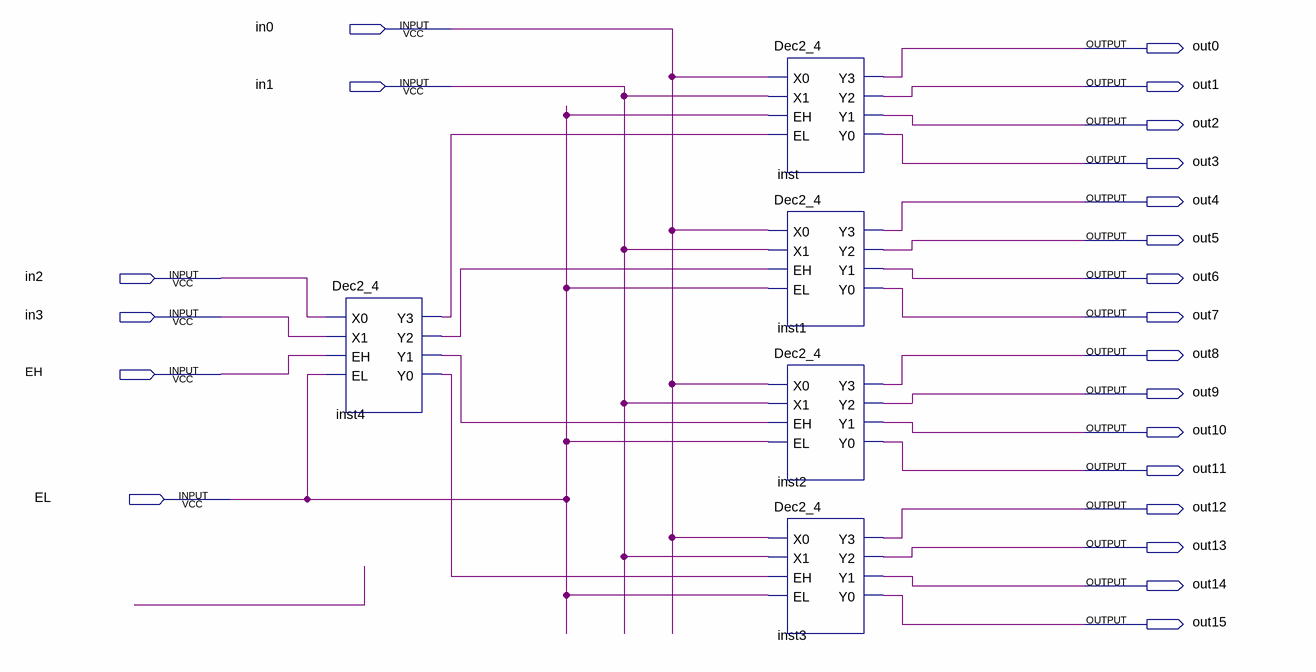
[diagram p0: schematic sheet]
// Quartus schematic Dec2_16.bdf as structural Verilog: 5 symbols, 22 pins
module Dec2_16 (
  input  in0,
  input  in1,
  input  in2,
  input  in3,
  input  EH,
  input  EL,
  output out0,
  output out1,
  output out2,
  output out3,
  output out4,
  output out5,
  output out6,
  output out7,
  output out8,
  output out9,
  output out10,
  output out11,
  output out12,
  output out13,
  output out14,
  output out15
);

  wire inst4_y0, inst4_y1, inst4_y2, inst4_y3;

  Dec2_4 inst4 (.X0(in2), .X1(in3), .EH(EH), .EL(EL), .Y3(inst4_y3), .Y2(inst4_y2), .Y1(inst4_y1), .Y0(inst4_y0));
  Dec2_4 inst (.X0(in0), .X1(in1), .EH(EL), .EL(inst4_y3), .Y3(out0), .Y2(out1), .Y1(out2), .Y0(out3));
  Dec2_4 inst1 (.X0(in0), .X1(in1), .EH(inst4_y2), .EL(EL), .Y3(out4), .Y2(out5), .Y1(out6), .Y0(out7));
  Dec2_4 inst2 (.X0(in0), .X1(in1), .EH(inst4_y1), .EL(EL), .Y3(out8), .Y2(out9), .Y1(out10), .Y0(out11));
  Dec2_4 inst3 (.X0(in0), .X1(in1), .EH(inst4_y0), .EL(EL), .Y3(out12), .Y2(out13), .Y1(out14), .Y0(out15));
endmodule
